# EAGLE schematic rw-fet-cc-24mm-mk-1.0.1 (EAGLE 7.5.0)
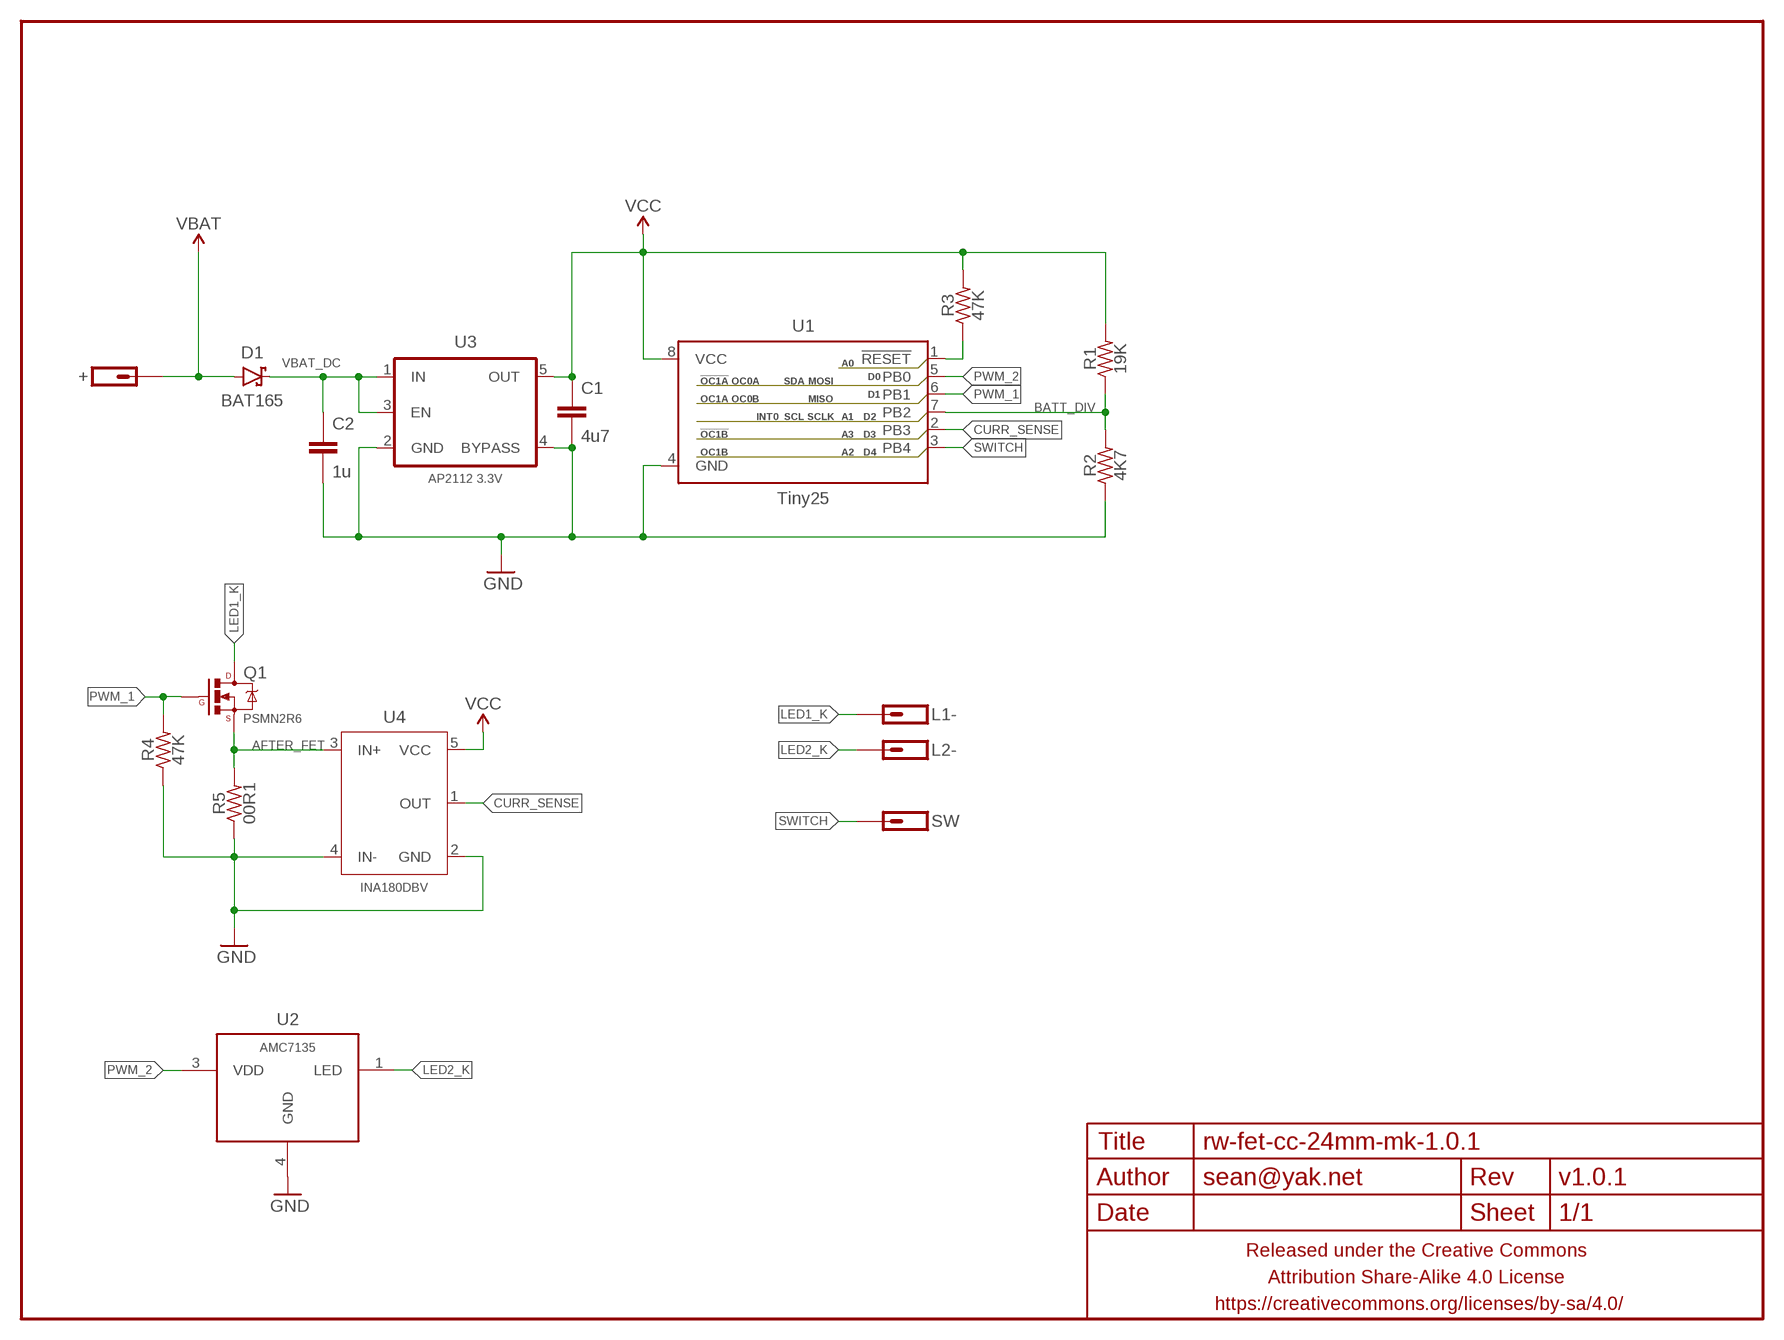
[diagram p0: schematic, sheet 1]

## Parts
+  M01PTH-1MM-CIR-NS  [1X01-1MM-CIR-NS]
C1  4u7  CAPACITOR-CERAMICC0603-TIGHTER  [C0603-TIGHTER]
C2  1u  CAPACITOR-CERAMICC0402  [C0402]
D1  BAT165  DIODE-SCHOTTKYSOD323  [SOD323-SCHOTTKY]
FRAME1  FRAME-LETTERNO_PACKAGE  [DUMMY]
L1-  M011X01-0.9MM-CIR  [1X01-0.9MM-CIR]
L2-  M01PTH-0.8MM-CIR  [1X01-0.8MM-CIR]
Q1  PSMN2R6  MOSFET-NCHANNELSIR800DP  [POWERPACK-SO-8]
R1  19K  RESISTORR0402  [R0402]
R2  4K7  RESISTORR0402  [R0402]
R3  47K  RESISTORR0402  [R0402]
R4  47K  RESISTORR0402  [R0402]
R5  00R1  RESISTORR1206  [R1206]
SW  M01SMD-0.8MM-DIA-NS  [1X01-SMD-0.8MM-DIA-NS]
U1  Tiny25  ATTINY13SOIC-NARROWPADS  [SO08-NARROWER]
U2  AMC7135  AMC7135SOT-89-NOTHERM-ROUNDED-LESS  [SOT89-NOTHERM-ROUNDED-LESS]
U3  AP2112 3.3V  V_REG_SOT-23-5AP2112  [SOT23-5]
U4  INA180DBV  [SOT23-5]

## Nets
AFTER_FET: Q1.1(S) Q1.2(S) Q1.3(S) R5.2 U4.3(IN+)
BATT_DIV: R1.1 R2.2 U1.7(PB2)
CURR_SENSE: U1.2(PB3) U4.1(OUT)
GND: C1.2 C2.2 R2.1 R4.1 R5.1 U1.4(GND) U2.4(GND) U3.2(GND) U3.4(BYPASS) U4.2(GND) U4.4(IN-)
LED1_K: L1-.P$1 Q1.5678(D)
LED2_K: L2-.1 U2.1(LED)
N$1: R3.1 U1.1(!RESET)
PWM_1: Q1.4(G) R4.2 U1.6(PB1)
PWM_2: U1.5(PB0) U2.3(VDD)
SWITCH: SW.P$1 U1.3(PB4)
VBAT: +.1 D1.A
VBAT_DC: C2.1 D1.C U3.1(IN) U3.3(EN)
VCC: C1.1 R1.2 R3.2 U1.8(VCC) U3.5(OUT) U4.5(VCC)

## Library data of the parts
+ L1- L2- SW = a_parts:M01: Header 1 Standard 1-pin 0.1" header. Use with straight break away headers (SKU : PRT-00116), right angle break away headers (PRT-00553), swiss pins (PRT-00743), machine pins (PRT-00117), and female headers (PRT-00115).
C1 C2 = a_parts:CAPACITOR-CERAMIC: CAPACITOR, European symbol
D1 = a_parts:DIODE-SCHOTTKY: Schottky diodes in SFE's production catalog BAT20J 1A 23V 0.62Vf RB751 120mA 40V 0.37Vf PMEG4005EJ 0.5A 40V 0.42Vf MBRA140 1A 40V 0.5Vf B340A 3A 40V SMA
FRAME1 = a_parts:FRAME-LETTER: Schematic Frame Standard 8.5x11 US Letter frame; DESIGNER: sean@yak.net; VERSION: v1.0.1
Q1 = a_parts:MOSFET-NCHANNEL: Common NMOSFET Parts MFG P/N Store ID Prod ID FDD8780 TRANS-09984 SI7820DN TRANS-11055 FDS6630A IC-08089 2N7002PW TRANS-11151 FQP30N06L COM-10213 TRANS-10060 BSS123LT1G TRANS-08345 BSS138 TRANS-00830 BS170 2N7000
R1-R5 = a_parts:RESISTOR: RESISTOR, American symbol
U1 = a_parts:ATTINY13: Atmel 8-pin 1kB flash uC
U2 = a_parts:AMC7135
U3 = a_parts:V_REG_SOT-23-5
U4 = a_parts:INA180